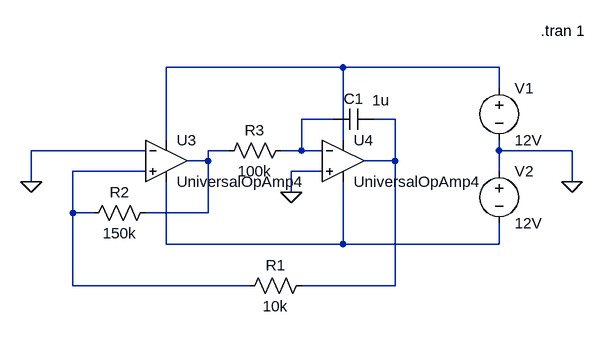
[diagram p0: schematic Draft10.asc]
Draft10.asc, the LTspice schematic file:
Version 4
SHEET 1 880 680
WIRE -464 -368 -736 -368
WIRE -224 -368 -464 -368
WIRE -224 -336 -224 -368
WIRE -480 -288 -528 -288
WIRE -384 -288 -416 -288
WIRE -736 -256 -736 -368
WIRE -464 -256 -464 -368
WIRE -768 -240 -944 -240
WIRE -640 -240 -672 -240
WIRE -528 -240 -528 -288
WIRE -528 -240 -560 -240
WIRE -496 -240 -528 -240
WIRE -224 -240 -224 -256
WIRE -112 -240 -224 -240
WIRE -672 -224 -672 -240
WIRE -672 -224 -704 -224
WIRE -384 -224 -384 -288
WIRE -384 -224 -432 -224
WIRE -768 -208 -880 -208
WIRE -496 -208 -544 -208
WIRE -224 -208 -224 -240
WIRE -944 -192 -944 -240
WIRE -112 -192 -112 -240
WIRE -544 -176 -544 -208
WIRE -880 -144 -880 -208
WIRE -848 -144 -880 -144
WIRE -672 -144 -672 -224
WIRE -672 -144 -768 -144
WIRE -736 -96 -736 -192
WIRE -464 -96 -464 -192
WIRE -464 -96 -736 -96
WIRE -224 -96 -224 -128
WIRE -224 -96 -464 -96
WIRE -880 -32 -880 -144
WIRE -608 -32 -880 -32
WIRE -384 -32 -384 -224
WIRE -384 -32 -528 -32
FLAG -112 -192 0
FLAG -544 -176 0
FLAG -944 -192 0
SYMBOL voltage -224 -352 R0
SYMATTR InstName V1
SYMATTR Value 12V
SYMBOL voltage -224 -224 R0
SYMATTR InstName V2
SYMATTR Value 12V
SYMBOL res -512 -48 R90
WINDOW 0 0 56 VBottom 2
WINDOW 3 32 56 VTop 2
SYMATTR InstName R1
SYMATTR Value 10k
SYMBOL res -752 -160 R90
WINDOW 0 0 56 VBottom 2
WINDOW 3 32 56 VTop 2
SYMATTR InstName R2
SYMATTR Value 150k
SYMBOL res -544 -256 R90
WINDOW 0 0 56 VBottom 2
WINDOW 3 32 56 VTop 2
SYMATTR InstName R3
SYMATTR Value 100k
SYMBOL cap -480 -272 R270
WINDOW 0 32 32 VTop 2
WINDOW 3 61 74 VBottom 2
SYMATTR InstName C1
SYMATTR Value 1u
SYMBOL OpAmps/UniversalOpAmp4 -736 -224 R0
SYMATTR InstName U3
SYMBOL OpAmps/UniversalOpAmp4 -464 -224 R0
SYMATTR InstName U4
TEXT -160 -424 Left 2 !.tran 1

The netlist it stands for:
* Draft10.asc
V1 N001 0 12V
V2 0 N006 12V
R1 N003 N005 10k
R2 N004 N005 150k
R3 N002 N004 100k
C1 N002 N003 1u
* U3: UniversalOpAmp4 (symbol OpAmps/UniversalOpAmp4 not available, pins judged from their places): In+=N005 In-=0 V+=N001 V-=N006 OUT=N004
* U4: UniversalOpAmp4 (symbol OpAmps/UniversalOpAmp4 not available, pins judged from their places): In+=0 In-=N002 V+=N001 V-=N006 OUT=N003
.tran 1
.backanno
.end